# EasyEDA Pro project STM Embedded BD.eprj, schematic STM32 Embedded BD
Create Date: 2024-04-15; Page Name: 1 / 1; Project Name: STM Embedded BD; Schematic Name: STM32 Embedded BD; Update Date: 2024-04-16; Company: EasyEDA.com; Drawn: EasyEDA; Page Size: A4; Part Number: JLCPCB-002; Reviewed: EasyEDA; Version: V0.1
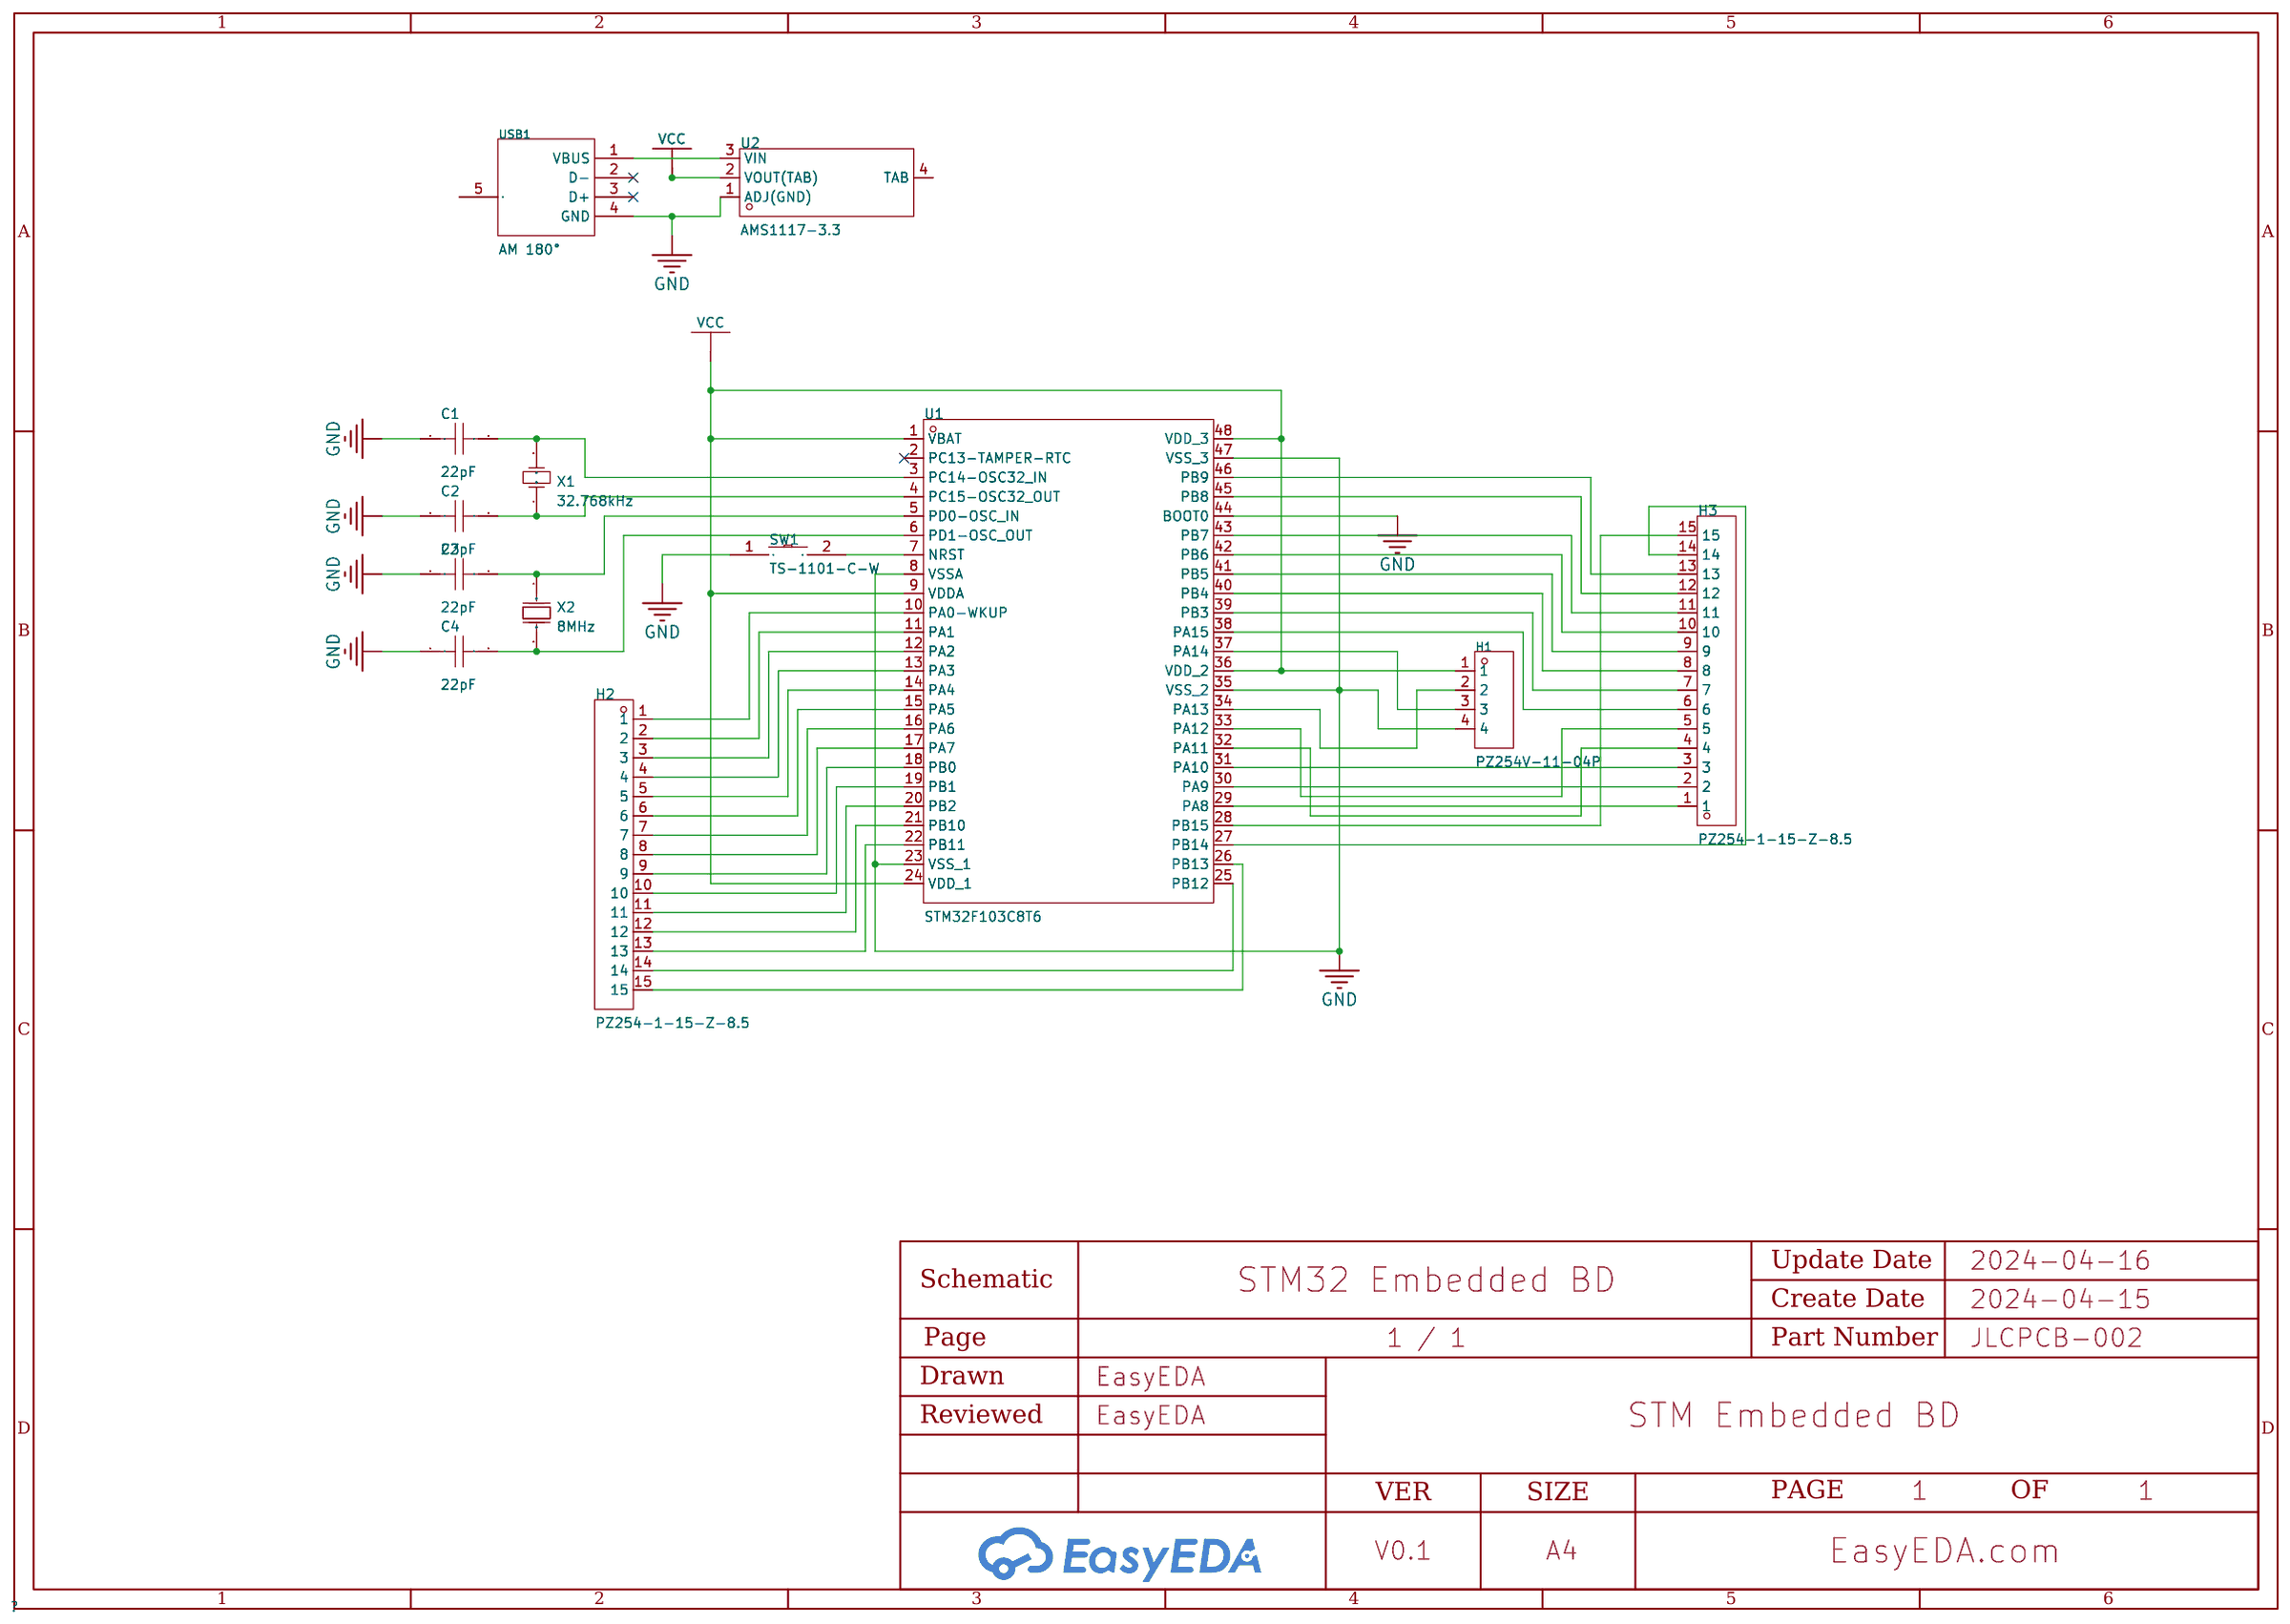
[diagram p0: schematic sheet]

## Parts
C1  22pF  [C0603]
C2  22pF  [C0603]
C3  22pF  [C0603]
C4  22pF  [C0603]
H1  PZ254V-11-04P  [HDR-TH_4P-P2.54-V-M]
H2  PZ254-1-15-Z-8.5  [HDR-TH_15P-P2.54-V-M]
H3  PZ254-1-15-Z-8.5  [HDR-TH_15P-P2.54-V-M]
SW1  TS-1101-C-W  [SW-SMD_L6.0-W3.3-LS8.0]
U1  STM32F103C8T6  [LQFP-48_L7.0-W7.0-P0.50-LS9.0-BL]
U2  AMS1117-3.3  [SOT-223-4_L6.5-W3.5-P2.30-LS7.0-BR]
USB1  AM 180°  [USB-SMD_AM180]
X1  32.768kHz  [OSC-TH_BD3.1-P0.8-D0.3]
X2  8MHz  [CRYSTAL-SMD_L11.5-W4.8-LS12.7]

## Library data of the parts
C1-C4 = 0603CG220J500NT: Capacitance: Tolerance:±5% Tolerance:±5% Voltage Rated: Temperature Coefficient:; LCSC Part Name: 22pF ±5% 50V; Supplier Part: C91701; Manufacturer: FH(风华); Supplier Footprint: 0603; JLCPCB Part Class: Extended Part; Datasheet: https://atta.szlcsc.com/upload/public/pdf/source/20200305/C486355_26A10D38EF8C2A5C37091D0039909270.pdf; Supplier: LCSC; Tolerance: ±5%
H1 = PZ254V-11-04P: Pin Structure:1x4P Pitch:2.54mm Row Spacing:- Circluar Pins/Square Pins:Square Pins Mounting Type:Straight Number of Rows:Plugin Number of Pins:4P Current Rating (Max):3A Voltage Rating (Max):250V Length of Mating Pin:6mm Insulation Height:2.5mm Length of; LCSC Part Name: 间距:2.54mm 1x4P 直插 方针; Supplier Part: C2691448; Manufacturer: XFCN(兴飞); Supplier Footprint: 插件,P=2.54mm; JLCPCB Part Class: Extended Part; Datasheet: https://atta.szlcsc.com/upload/public/pdf/source/20200309/C492403_F9F19131791D08044AD4F84F8E751A34.pdf; Supplier: LCSC; Pin Structure: 1x4P; Pitch: 2.54mm; Circluar Pins/Square Pins: Square Pins; Mounting Type: Straight; Number of Rows: Plugin; Number of Pins: 4P; Current Rating (Max): 3A; Voltage Rating (Max): 250V; Length of Mating Pin: 6mm; Insulation Height: 2.5mm; Length of End Connection Pin: 3mm; Operating Temperature Range: -40℃~+105℃; Color: Black
H2 H3 = PZ254-1-15-Z-8.5_C2894938: Pin Structure:1x15P Pitch:2.54mm Row Spacing:- Circluar Pins/Square Pins:Square Pins Mounting Type:Straight Number of Rows:Plugin Number of Pins:15P Current Rating (Max):3A Voltage Rating (Max):- Length of Mating Pin:6mm Insulation Height:2.5mm Length of; LCSC Part Name: 1x15P 间距:2.54mm 方针 直插; Supplier Part: C2894938; Manufacturer: HCTL(华灿天禄); Supplier Footprint: 插件,P=2.54mm; JLCPCB Part Class: Extended Part; Datasheet: https://atta.szlcsc.com/upload/public/pdf/source/20230609/805D25CEF03592837AF6F506EEB5ED41.pdf; Supplier: LCSC; Pin Structure: 1x15P; Pitch: 2.54mm; Circluar Pins/Square Pins: Square Pins; Mounting Type: Straight; Number of Rows: Plugin; Number of Pins: 15P; Current Rating (Max): 3A; Length of Mating Pin: 6mm; Insulation Height: 2.5mm; Length of End Connection Pin: 3mm; Operating Temperature Range: -40℃~+105℃; Soldering Temperature(Max): 260℃@10S; Color: Black
SW1 = TS-1101-C-W: Circuit:SPST Actuator Style:Rectangle button Operating Force:260gf Mounting Style:Brick nogging Switch Length:6mm Switch Width:3.6mm Switch Height:2.5mm Strike Gundam:不带 Contact Current:50mA Voltage Rating (AC):- Voltage Rating (DC):12V Power Rating:- Ins; LCSC Part Name: 6*3.6*2.5mm 立贴 轻触开关; Supplier Part: C318938; Manufacturer: XKB Connectivity(中国星坤); Supplier Footprint: SMD; JLCPCB Part Class: Extended Part; Datasheet: https://atta.szlcsc.com/upload/public/pdf/source/20200227/C318938_C2E53B1EEDE37D980A33616AC086DE53.pdf; Supplier: LCSC; Circuit: SPST; Actuator Style: Rectangle button; Operating Force: 260gf; Mounting Style: Brick nogging; Switch Length: 6mm; Switch Width: 3.6mm; Switch Height: 2.5mm; Strike Gundam: 不带; Contact Current: 50mA; Voltage Rating (DC): 12V; Actuator/Cap Color: 白色带淡绿; With Lamp: No; Mechanical Life: 5万次; Operating Temperature: -30℃~+85℃
U1 = STM32F103C8T6: CPU Core:CM3 Program Storage Size:64KB RAM Size:20KB GPIO Ports Number:37 Operating Voltage Range:2V~3.6V Operating Voltage Range:2V~3.6V CPU Maximum Speed:72MHz Program Memory Type:FLASH Operating Temperature Range:-40℃~+85℃ Operating Temperature Range:-; LCSC Part Name: STM32F103C8T6 MSL=3; Supplier Part: C8734; Manufacturer: ST(意法半导体); Supplier Footprint: LQFP-48(7x7); JLCPCB Part Class: Extended Part; Datasheet: https://atta.szlcsc.com/upload/public/pdf/source/20220812/8363ACEC51AD55ECEB84799464F7CB85.pdf; Supplier: LCSC; CPU Core: CM3; Program Storage Size: 64KB; RAM Size: 20KB; GPIO Ports Number: 37; Operating Voltage Range: 2V~3.6V; CPU Maximum Speed: 72MHz; Program Memory Type: FLASH; Operating Temperature Range: -40℃~+85℃; ADC (Bit): 12bit; Universal Serial Bus: 有; Peripheral/Function: WDT；DMA；WDT；On-chip temperature sensor; Watchdog: 有; Infrared Data Association: 有; Low-Voltage Detect: 有; Direct Memory Access: 有; Internal Oscillator: 有
U2 = AMS1117-3.3_C347222: Output Type: Maximum Input Voltage:12V Output Voltage:3.3V Output Voltage:3.3V MAX Output Current:1A Power Supply Rejection Ratio (PSRR):60dB@(120Hz) Dropout Voltage:1.3V@(1A) standby current:- Noise:- Feature:- Operating Temperature:- Operating Temperatu; LCSC Part Name: 输出:3.3V 电流:1A 耐压:12V; Supplier Part: C347222; Manufacturer: UMW(友台半导体); Supplier Footprint: SOT-223; JLCPCB Part Class: Extended Part; Datasheet: https://atta.szlcsc.com/upload/public/pdf/source/20231109/155D79A26D9DB04352555A58D5969DC8.pdf; Supplier: LCSC; Maximum Input Voltage: 12V; Output Voltage: 3.3V; MAX Output Current: 1A; Power Supply Rejection Ratio (PSRR): 60dB@(120Hz); Dropout Voltage: 1.3V@(1A); Output Polarity: Positive electrode; Number of Outputs: 1
USB1 = AM 180°: Connector Type:Type-A Standard:USB 2.0 Gender:公 Number of Ports:1 Number of Contacts:4P Mounting Style:卧贴 Current Rating - Power (Max):1A Operating Temperature Range:-40℃~+60℃ Operating Temperature Range:-40℃~+60℃; LCSC Part Name: Type-A 公 卧贴; Supplier Part: C2681564; Manufacturer: SHOU HAN(首韩); Supplier Footprint: SMD; JLCPCB Part Class: Extended Part; Datasheet: https://atta.szlcsc.com/upload/public/pdf/source/20210107/C2681564_25DA62A2D5638CEDBC3A14F60B11E72F.pdf; Supplier: LCSC; Connector Type: Type-A; Standard: USB 2.0; Gender: 公; Number of Ports: 1; Number of Contacts: 4P; Mounting Style: 卧贴; Current Rating - Power (Max): 1A; Operating Temperature Range: -40℃~+60℃
X1 = X308032768KGB2SC: Crystal Type:直插晶振 Frequency: Normal temperature Frequency Tolerance:±10ppm Normal temperature Frequency Tolerance:±10ppm External load capacitor: Frequency Stability(Full temperature range):- Frequency Stability(Full temperature range):- Operating Tempera; LCSC Part Name: 32.768kHz ±10ppm 12.5pF YT-38; Supplier Part: C52082; Manufacturer: YXC(扬兴晶振); Supplier Footprint: DT-38; JLCPCB Part Class: Extended Part; Datasheet: https://atta.szlcsc.com/upload/public/pdf/source/20240329/231E1A1EB7C875CD193DBE6664A3DE3A.pdf; Supplier: LCSC; Crystal Type: 直插晶振; Normal temperature Frequency Tolerance: ±10ppm
X2 = X49SM8MSD2SC: Crystal Type:贴片晶振 Frequency: Normal temperature Frequency Tolerance:±20ppm Normal temperature Frequency Tolerance:±20ppm External load capacitor: Frequency Stability(Full temperature range):±30ppm Frequency Stability(Full temperature range):±30ppm Operati; LCSC Part Name: 8MHz ±20ppm 20pF; Supplier Part: C12674; Manufacturer: YXC(扬兴晶振); Supplier Footprint: HC-49S-SMD; JLCPCB Part Class: Basic Part; Datasheet: https://atta.szlcsc.com/upload/public/pdf/source/20240329/3EBF42EBCAB50CA65B6FA9D7CFA1955A.pdf; Supplier: LCSC; Crystal Type: 贴片晶振; Normal temperature Frequency Tolerance: ±20ppm; Frequency Stability(Full temperature range): ±30ppm

## Nets
GND: C1.1 C2.1 C3.1 C4.1 H1.4 SW1.1 U1.8(VSSA) U1.23(VSS_1) U1.35(VSS_2) U1.44(BOOT0) U1.47(VSS_3) U2.1(ADJ(GND)) USB1.4(GND)
VCC: H1.1 U1.1(VBAT) U1.9(VDDA) U1.24(VDD_1) U1.36(VDD_2) U1.48(VDD_3) U2.2(VOUT(TAB))
$3N746: U2.3(VIN) USB1.1(VBUS)
$3N1678: C3.2 U1.5(PD0-OSC_IN) X2.1(OSC1)
$3N1684: C4.2 U1.6(PD1-OSC_OUT) X2.2(OSC2)
$3N2120: SW1.2 U1.7(NRST)
Net-(C1-2): C1.2 U1.3(PC14-OSC32_IN) X1.2(OSC2)
Net-(C2-2): C2.2 U1.4(PC15-OSC32_OUT) X1.1(OSC1)
Net-(H1-2): H1.2 U1.34(PA13)
Net-(H1-3): H1.3 U1.37(PA14)
Net-(H2-1): H2.1 U1.10(PA0-WKUP)
Net-(H2-2): H2.2 U1.11(PA1)
Net-(H2-3): H2.3 U1.12(PA2)
Net-(H2-4): H2.4 U1.13(PA3)
Net-(H2-5): H2.5 U1.14(PA4)
Net-(H2-6): H2.6 U1.15(PA5)
Net-(H2-7): H2.7 U1.16(PA6)
Net-(H2-8): H2.8 U1.17(PA7)
Net-(H2-9): H2.9 U1.18(PB0)
Net-(H2-10): H2.10 U1.19(PB1)
Net-(H2-11): H2.11 U1.20(PB2)
Net-(H2-12): H2.12 U1.21(PB10)
Net-(H2-13): H2.13 U1.22(PB11)
Net-(H2-14): H2.14 U1.25(PB12)
Net-(H2-15): H2.15 U1.26(PB13)
Net-(H3-1): H3.1 U1.29(PA8)
Net-(H3-2): H3.2 U1.30(PA9)
Net-(H3-3): H3.3 U1.31(PA10)
Net-(H3-4): H3.4 U1.32(PA11)
Net-(H3-5): H3.5 U1.33(PA12)
Net-(H3-6): H3.6 U1.38(PA15)
Net-(H3-7): H3.7 U1.39(PB3)
Net-(H3-8): H3.8 U1.40(PB4)
Net-(H3-9): H3.9 U1.41(PB5)
Net-(H3-10): H3.10 U1.42(PB6)
Net-(H3-11): H3.11 U1.43(PB7)
Net-(H3-12): H3.12 U1.45(PB8)
Net-(H3-13): H3.13 U1.46(PB9)
Net-(H3-14): H3.14 U1.27(PB14)
Net-(H3-15): H3.15 U1.28(PB15)

Not connected (* = marked no-connect by the designer): U1 2(PC13-TAMPER-RTC)*; U2 4(TAB); USB1 2(D-)* 3(D+)* 5(EH)
